# Altium schematic sheet Isense.SchDoc
size A
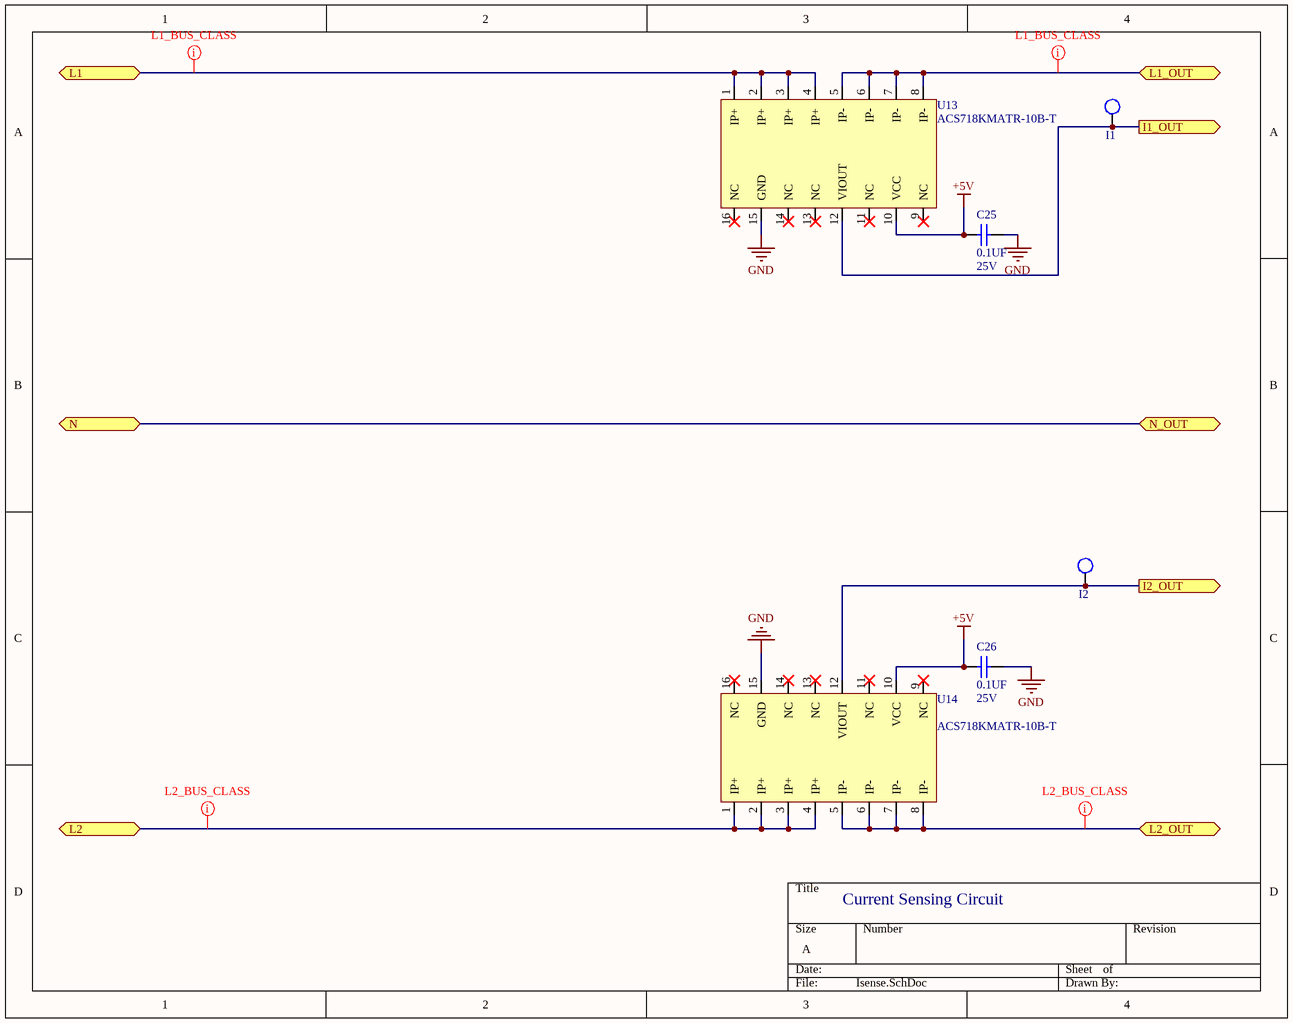
[diagram p0: Isense.SchDoc]

## Parts
C25  Capacitance: 0.1UF  Voltage - Rated: 25V  [CAPC3216X16N]  (hidden comment: GRM319R71E104KA01J)
C26  Capacitance: 0.1UF  Voltage - Rated: 25V  [CAPC3216X16N]  (hidden comment: GRM319R71E104KA01J)
I1  Testpoint  [Testpoint]  (value not drawn)
I2  Testpoint  [Testpoint]  (value not drawn)
U13  ACS718KMATR-10B-T  [SOIC127P1030X265-16N]
U14  ACS718KMATR-10B-T  [SOIC127P1030X265-16N]

## Ports
I1_OUT (out), I2_OUT (out), L1 (bidir), L1_OUT (bidir), L2 (bidir), L2_OUT (bidir), N (bidir), N_OUT (bidir)

## Nets
+5V: C25.1 C26.1 U13.10(VCC) U14.10(VCC)
GND: C25.2 C26.2 U13.15(GND) U14.15(GND)
I1_OUT: I1.1(TP) U13.12(VIOUT) ; port I1_OUT
I2_OUT: I2.1(TP) U14.12(VIOUT) ; port I2_OUT
L1: U13.1(IP+) U13.2(IP+) U13.3(IP+) U13.4(IP+) ; port L1
L1_OUT: U13.5(IP-) U13.6(IP-) U13.7(IP-) U13.8(IP-) ; port L1_OUT
L2: U14.1(IP+) U14.2(IP+) U14.3(IP+) U14.4(IP+) ; port L2
L2_OUT: U14.5(IP-) U14.6(IP-) U14.7(IP-) U14.8(IP-) ; port L2_OUT
N: port N, port N_OUT

Not connected (* = marked no-connect by the designer): U13 9(NC)* 11(NC)* 13(NC)* 14(NC)* 16(NC)*; U14 9(NC)* 11(NC)* 13(NC)* 14(NC)* 16(NC)*

## Layout directives
net class L1_BUS_NETS: L1, L1_OUT
net class L2_BUS_NETS: L2, L2_OUT

## Notes on the sheet
- Current Sensing Circuit

## Library data of the parts
C25 C26 = GRM319R71E104KA01J: CAP CER 0.1UF 25V X7R 1206; Manufacturer: Murata Electronics North America; Manufacturer Part Number: GRM319R71E104KA01J; Supplier 1: Digi-Key; Supplier Part Number 1: 490-12564-1-ND
U13 U14 = ACS718KMATR-10B-T: SENSOR CURRENT HALL 10A AC/DC; Manufacturer: Allegro MicroSystems, LLC; Supplier 1: Digi-Key; Supplier Part Number 1: 620-1713-1-ND; Manufacturer Part Number: ACS718KMATR-10B-T